# Altium schematic sheet 42CAN.SchDoc
size A3; SheetNumber: 1; SheetTotal: 1
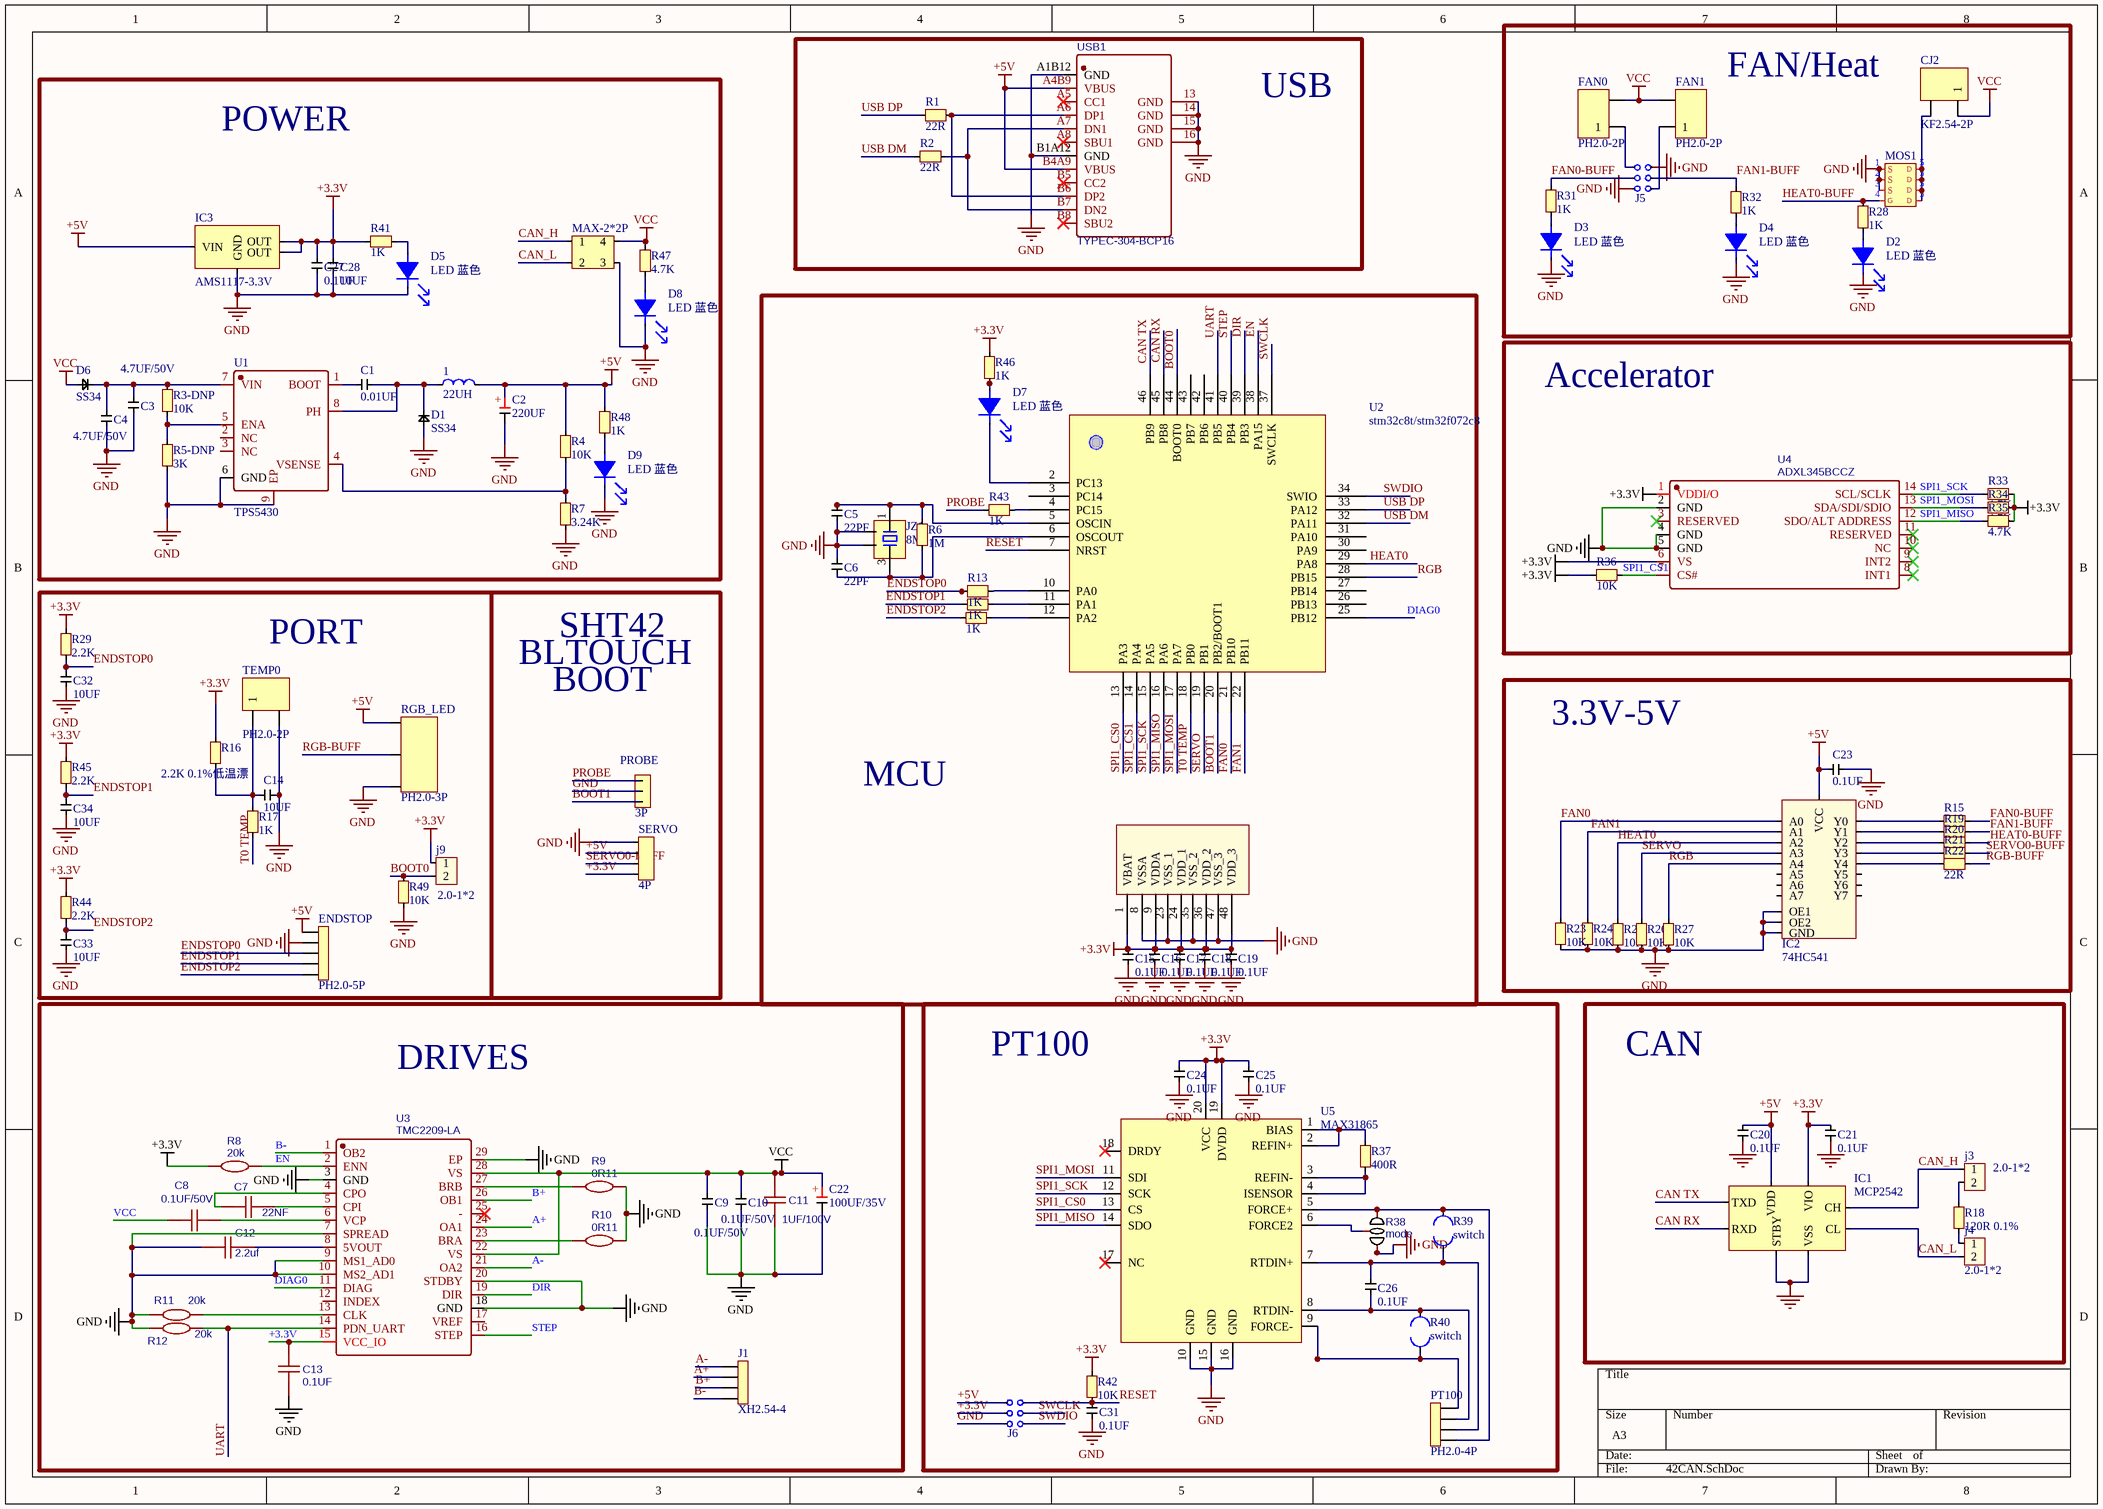
[diagram p0: 42CAN.SchDoc]

## Parts
1  22UH  [7*7电感]
C1  0.01UF  [C0402]
C2  220UF  [3528B]
C3  4.7UF/50V  [C0805]
C4  4.7UF/50V  [C0805]
C5  22PF  [C0402]
C6  22PF  [C0402]
C7  22NF  [C0402]
C8  0.1UF/50V  [0603]
C9  0.1UF/50V  [0603C]
C10  0.1UF/50V  [0603C]
C11  1UF/100V  [0603]
C12  2.2uf  [C0402]
C13  0.1UF  [C0402]
C14  10UF  [C0402]
C15  0.1UF  [C0402]
C16  0.1UF  [C0402]
C17  0.1UF  [C0402]
C18  0.1UF  [C0402]
C19  0.1UF  [C0402]
C20  0.1UF  [0603C]
C21  0.1UF  [0603C]
C22  100UF/35V  [6.3*7.7电解电容]
C23  0.1UF  [C0402]
C24  0.1UF  [C0402]
C25  0.1UF  [C0402]
C26  0.1UF  [C0402]
C27  0.1UF  [C0402]
C28  10UF  [C0402]
C31  0.1UF  [C0402]
C32  10UF  [C0402]
C33  10UF  [C0402]
C34  10UF  [C0402]
CJ2  KF2.54-2P  [KF2.54-2P]
D1  SS34  [SMA]
D2  LED 蓝色  [0402led]
D3  LED 蓝色  [0402led]
D4  LED 蓝色  [0402led]
D5  LED 蓝色  [0402led]
D6  SS34  [SMA]
D7  LED 蓝色  [0402led]
D8  LED 蓝色  [0402led]
D9  LED 蓝色  [0402led]
ENDSTOP  PH2.0-5P  [PH2.0-5P]
FAN0  PH2.0-2P  [PH2.0-2P]
FAN1  PH2.0-2P  [PH2.0-2P]
IC1  MCP2542  [SOIC-8]
IC2  74HC541  [TSSOP-20]
IC3  AMS1117-3.3V  [AMS1117]
J1  XH2.54-4  [XH2.54-4]
j3  2.0-1*2  [2.0MM-1*2P -插针]
j4  2.0-1*2  [2.0MM-1*2P -插针]
J5  2*3排母-2.0-镀金  [2.0MM-2*3P 排母]  (value not drawn)
J6  2*3排母-2.0-镀金  [2.0MM-2*3P -插针]  (value not drawn)
j9  2.0-1*2  [2.0MM-1*2P -插针]
JZ1  8M  [OSC-3225-4P]
MAX-2*2P  2*4P-2.54排针_1  [MX4.2-2*2P]  (value not drawn)
MOS1  HSBB6115  [PRPAK3*3]  (value not drawn)
PROBE  3P  [3P]
PT100  PH2.0-4P  [PH2.0-4P]
R1  22R  [R0402]
R2  22R  [R0402]
R3-DNP  10K  [R0402]
R4  10K  [R0402]
R5-DNP  3K  [R0402]
R6  1M  [R0402]
R7  3.24K  [R0402]
R8  20k  [R0402]
R9  0R11  [0805]
R10  0R11  [0805]
R11  20k  [R0402]
R12  20k  [R0402]
R13  1K  [R0402]
R14  1K  [R0402]
R15  1K  [R0402]
R16  2.2K 0.1%低温漂  [R0402]
R17  1K  [R0402]
R18  120R 0.1%  [0603]
R19  1K  [R0402]
R20  1K  [R0402]
R21  1K  [R0402]
R22  22R  [R0402]
R23  10K  [R0402]
R24  10K  [R0402]
R25  10K  [R0402]
R26  10K  [R0402]
R27  10K  [R0402]
R28  1K  [R0402]
R29  2.2K  [R0402]
R30  1K  [R0402]
R31  1K  [R0402]
R32  1K  [R0402]
R33  4.7K  [R0402]
R34  4.7K  [R0402]
R35  4.7K  [R0402]
R36  10K  [R0402]
R37  400R  [0603]
R38  mode  [switch2]
R39  switch  [switch]
R40  switch  [switch]
R41  1K  [R0402]
R42  10K  [R0402]
R43  1K  [R0402]
R44  2.2K  [R0402]
R45  2.2K  [R0402]
R46  1K  [R0402]
R47  4.7K  [R0402]
R48  1K  [R0402]
R49  10K  [0603]
RGB_LED  PH2.0-3P  [PH2.0-3P]
SERVO  4P  [4p]
TEMP0  PH2.0-2P  [PH2.0-2P]
U1  TPS5430  [TPS5430]
U2  stm32c8t/stm32f072c8  [LQFP-48]
U3  TMC2209-LA  [TMC2209]
U4  ADXL345BCCZ  [ADXL345]
U5  MAX31865  [QFN20]
USB1  TYPEC-304-BCP16  [USB-C-SMD_TYPEC-304-BCP16]

## Blocks framed on the sheet
USB: R1 R2 USB1
FAN/Heat: CJ2 D2-D4 FAN0 FAN1 J5 MOS1 R28 R31 R32
POWER: 1 C1-C4 C27 C28 D1 D5 D6 D8 D9 IC3 MAX-2*2P R3-DNP R4 R5-DNP R7 R41 R47 R48 U1
MCU: C5 C6 C15-C19 D7 JZ1 R6 R13 R14 R30 R43 R46 U2
Accelerator: R33-R36 U4
3.3V-5V: C23 IC2 R15 R19-R27
DRIVES: C7-C13 C22 J1 R8-R12 U3
PT100: C24-C26 C31 J6 PT100 R37-R40 R42 U5
CAN: C20 C21 IC1 j3 j4 R18

## Nets
+3.3V: C13.1 C15.1 C16.1 C17.1 C18.1 C19.1 C21.1 C24.1 C25.1 C27.2 C28.2 IC1.5(VIO) IC3.2(OUT) IC3.4(OUT) J6.5 j9.1 R8.1 R16.2 R29.2 R33.1 R34.1 R35.1 R36.2 R41.2 R42.1 R44.2 R45.2 R46.1 SERVO.4 U2.1(VBAT) U2.9(VDDA) U2.24(VDD_1) U2.36(VDD_2) U2.48(VDD_3) U3.15(VCC_IO) U4.1(VDDI/O) U4.6(VS) U5.19(DVDD) U5.20(VCC)
+5V: 1.1 C2.1 C20.1 C23.1 ENDSTOP.1 IC1.3(VDD) IC2.20(VCC) IC3.3(VIN) J6.4 R4.2 R48.2 RGB_LED.1 SERVO.2 USB1.A4B9(VBUS) USB1.B4A9(VBUS)
GND: C2.2 C3.2 C4.2 C5.1 C6.2 C9.2 C10.2 C11.1 C12.2 C13.2 C14.2 C15.2 C16.2 C17.2 C18.2 C19.2 C20.2 C21.2 C22.2 C23.2 C24.2 C25.2 C27.1 C28.1 C31.2 C32.2 C33.2 C34.2 D1.1 D2.2 D3.2 D4.2 D5.2 D8.2 D9.2 ENDSTOP.2 IC1.2(VSS) IC1.8(STBY) IC2.1(OE1) IC2.10(GND) IC2.19(OE2) IC3.1(GND) J5.3 J5.6 J6.6 JZ1.2 JZ1.4 MAX-2*2P.3 MOS1.1(S) MOS1.2(S) MOS1.3(S) PROBE.2 R5-DNP.1 R7.1 R9.2 R10.2 R11.1 R12.1 R23.1 R24.1 R25.1 R26.1 R27.1 R38.1 R49.2 RGB_LED.3 SERVO.1 TEMP0.2 U1.6(GND) U1.9(EP) U2.8(VSSA) U2.23(VSS_1) U2.35(VSS_2) U2.47(VSS_3) U3.3(GND) U3.7(SPREAD) U3.9(MS1_AD0) U3.10(MS2_AD1) U3.18(GND) U3.20(STDBY) U3.29(EP) U4.2(GND) U4.4(GND) U4.5(GND) U5.10(GND) U5.15(GND) U5.16(GND) USB1.13(GND) USB1.14(GND) USB1.15(GND) USB1.16(GND) USB1.A1B12(GND) USB1.B1A12(GND)
VCC: C8.2 C9.1 C10.1 C11.2 C22.1 CJ2.1 D6.1 FAN0.2 FAN1.2 MAX-2*2P.4 R47.2 U3.22(VS) U3.28(VS)
A+: J1.2 U3.24(OA1)
A-: J1.1 U3.21(OA2)
B+: J1.3 U3.26(OB1)
B-: J1.4 U3.1(OB2)
BOOT0: j9.2 R49.1 U2.44(BOOT0)
BOOT1: PROBE.3 U2.20(PB2/BOOT1)
CAN RX: IC1.4(RXD) U2.45(PB8)
CAN TX: IC1.1(TXD) U2.46(PB9)
CAN_H: IC1.7(CH) j3.1 MAX-2*2P.1
CAN_L: IC1.6(CL) j4.2 MAX-2*2P.2
DIAG0: U2.25(PB12) U3.11(DIAG)
DIR: U2.39(PB3) U3.19(DIR)
EN: R8.2 U2.38(PA15) U3.2(ENN)
ENDSTOP0: C32.1 ENDSTOP.3 R13.1 R29.1
ENDSTOP1: C34.1 ENDSTOP.4 R14.1 R45.1
ENDSTOP2: C33.1 ENDSTOP.5 R30.1 R44.1
FAN0: IC2.2(A0) R23.2 U2.21(PB10)
FAN0-BUFF: J5.5 R15.1 R31.1
FAN1: IC2.3(A1) R24.2 U2.22(PB11)
FAN1-BUFF: J5.2 R19.1 R32.1
HEAT0: IC2.4(A2) R25.2 U2.29(PA8)
HEAT0-BUFF: MOS1.4(G) R20.1 R28.1
PROBE: PROBE.1 R43.1
RESET: C31.1 J6.3 R42.2 U2.7(NRST)
RGB: IC2.6(A4) R27.2 U2.28(PB15)
RGB-BUFF: R22.1 RGB_LED.2
SERVO: IC2.5(A3) R26.2 U2.19(PB1)
SERVO0-BUFF: R21.1 SERVO.3
SPI1_CS0: U2.13(PA3) U5.13(CS)
SPI1_CS1: R36.1 U2.14(PA4) U4.7(CS#)
SPI1_MISO: R35.2 U2.16(PA6) U4.12(SDO/ALT_ADDRESS) U5.14(SDO)
SPI1_MOSI: R34.2 U2.17(PA7) U4.13(SDA/SDI/SDIO) U5.11(SDI)
SPI1_SCK: R33.2 U2.15(PA5) U4.14(SCL/SCLK) U5.12(SCK)
STEP: U2.40(PB4) U3.16(STEP)
SWCLK: J6.2 U2.37(SWCLK)
SWDIO: J6.1 U2.34(SWIO)
T0 TEMP: R17.1 U2.18(PB0)
UART: R12.2 U2.41(PB5) U3.14(PDN_UART)
USB DM: R2.2 U2.32(PA11)
USB DP: R1.2 U2.33(PA12)
Net1_2: 1.2 C1.2 D1.2 U1.8(PH)
NetC1_1: C1.1 U1.1(BOOT)
NetC3_1: C3.1 C4.1 D6.2 R3-DNP.2 U1.7(VIN)
NetC5_2: C5.2 JZ1.1 R6.2 U2.5(OSCIN)
NetC6_1: C6.1 JZ1.3 R6.1 U2.6(OSCOUT)
NetC7_1: C7.1 U3.4(CPO)
NetC7_2: C7.2 U3.5(CPI)
NetC8_1: C8.1 U3.6(VCP)
NetC12_1: C12.1 U3.8(5VOUT)
NetC14_1: C14.1 R16.1 R17.2 TEMP0.1
NetC26_1: C26.1 PT100.2 R39.2 U5.7(RTDIN+)
NetC26_2: C26.2 PT100.3 R40.1 U5.8(RTDIN-)
NetCJ2_2: CJ2.2 MOS1.5(D)
NetD2_1: D2.1 R28.2
NetD3_1: D3.1 R31.2
NetD4_1: D4.1 R32.2
NetD5_1: D5.1 R41.1
NetD7_1: D7.1 R46.2
NetD7_2: D7.2 U2.2(PC13)
NetD8_1: D8.1 R47.1
NetD9_1: D9.1 R48.1
NetFAN0_1: FAN0.1 J5.4
NetFAN1_1: FAN1.1 J5.1
NetIC2_14: IC2.14(Y4) R22.2
NetIC2_15: IC2.15(Y3) R21.2
NetIC2_16: IC2.16(Y2) R20.2
NetIC2_17: IC2.17(Y1) R19.2
NetIC2_18: IC2.18(Y0) R15.2
Netj3_2: j3.2 R18.2
Netj4_1: j4.1 R18.1
NetPT100_1: PT100.1 R38.3 R39.1 U5.5(FORCE+)
NetPT100_4: PT100.4 R40.2 U5.9(FORCE-)
NetR1_1: R1.1 USB1.A6(DP1) USB1.B6(DP2)
NetR2_1: R2.1 USB1.A7(DN1) USB1.B7(DN2)
NetR3-DNP_1: R3-DNP.1 R5-DNP.2 U1.5(ENA)
NetR4_1: R4.1 R7.2 U1.4(VSENSE)
NetR9_1: R9.1 U3.27(BRB)
NetR10_1: R10.1 U3.23(BRA)
NetR11_2: R11.2 U3.13(CLK)
NetR13_2: R13.2 U2.10(PA0)
NetR14_2: R14.2 U2.11(PA1)
NetR30_2: R30.2 U2.12(PA2)
NetR37_1: R37.1 U5.1(BIAS) U5.2(REFIN+)
NetR37_2: R37.2 U5.3(REFIN-) U5.4(ISENSOR)
NetR38_2: R38.2 U5.6(FORCE2)
NetR43_2: R43.2 U2.4(PC15)

Not connected (* = marked no-connect by the designer): IC2 7(A5) 8(A6) 9(A7) 11(Y7) 12(Y6) 13(Y5); U1 2(NC) 3(NC); U2 3(PC14) 26(PB13) 27(PB14) 30(PA9) 31(PA10) 42(PB6) 43(PB7); U3 12(INDEX) 17(VREF) 25(-)*; U4 3(RESERVED)* 8(INT1)* 9(INT2)* 10(NC)* 11(RESERVED)*; U5 17(NC)* 18(DRDY)*; USB1 A5(CC1)* A8(SBU1)* B5(CC2)* B8(SBU2)*

## Notes on the sheet
- PORT
- SHT42
- BLTOUCH
- BOOT
- (in symbol 电机电容) +
- (in symbol 钽电容) +

## Library data of the parts
1 = 电感
C1 C3-C6 C9 C10 C14-C19 C23-C28 C31-C34 = C
C2 = 钽电容: 328B
C7 C8 C12 C13 = 104: BOM_Manufacturer: Guangdong Fenghua Advanced Tech; BOM_Manufacturer Part: 0402CG680J250NT; nameAlias: Capacitance; Contributor: LCSC; BOM_Supplier: LCSC; BOM_Supplier Part: C285179; spicePre: C; spiceSymbolName: 0402CG680J250NT
C11 = 1uf: BOM_Manufacturer: KEMET; BOM_Manufacturer Part: C0603C225K4PACTU; nameAlias: Capacitance; Contributor: LCSC; BOM_Supplier: LCSC; BOM_Supplier Part: C452748; spicePre: C; spiceSymbolName: C0603C225K4PACTU
C20 C21 = 0603C
C22 = 电机电容
D2-D5 D7-D9 = LED 贴片
IC3 = AMS1117
J5 J6 = 2*3P
JZ1 = JZ3225
MOS1 = DFN5060
R1 R2 R3-DNP R4 R5-DNP R6 R7 R13-R17 R19-R36 R41-R49 = R
R8 R11 R12 = 20k: BOM_Manufacturer: TA-I Tech; BOM_Manufacturer Part: RMS04FT1821; nameAlias: Resistance (Ohms); Contributor: LCSC; BOM_Supplier: LCSC; BOM_Supplier Part: C208812; spicePre: R; spiceSymbolName: RMS04FT1821
R9 R10 = 0R11: BOM_Manufacturer: Uniroyal Elec; BOM_Manufacturer Part: 0805W8F3922T5E; nameAlias: Resistance (Ohms); Contributor: LCSC; SMT Type: Extend; BOM_Supplier: LCSC; BOM_Supplier Part: C60005; BOM_LCSC Assembly: Yes; spicePre: R; spiceSymbolName: 0805W8F3922T5E_C60005
R18 R37 = 0603R
R38 = mode: Contributor: FLYMAKER; spicePre: R; spiceSymbolName: mode
U2 = stm32F103C8T6/F072C8T6
U3 = TMC2209-LA: BOM_Manufacturer: TRINAMIC Motion Control GmbH; Contributor: LCSC; SMT Type: Extend; BOM_Supplier: LCSC; BOM_Supplier Part: C465949; BOM_Manufacturer Part: TMC2209-LA; BOM_LCSC Assembly: Yes; spicePre: U; spiceSymbolName: TMC2209-LA
U4 = ADXL345BCCZ: BOM_Manufacturer: ADI(亚德诺)/LINEAR; Contributor: LCSC; BOM_Supplier: LCSC; BOM_Supplier Part: C579456; BOM_Manufacturer Part: ADXL345BCCZ; BOM_JLCPCB Part Class: Extended Part; spicePre: U; spiceSymbolName: ADXL345BCCZ
USB1 = TYPEC-304-BCP16: BOM_Manufacturer: XUNPU; Contributor: LCSC; BOM_Supplier: LCSC; BOM_Supplier Part: C720629; BOM_Manufacturer Part: TYPEC-304-BCP16; spicePre: U; spiceSymbolName: TYPEC-304-BCP16